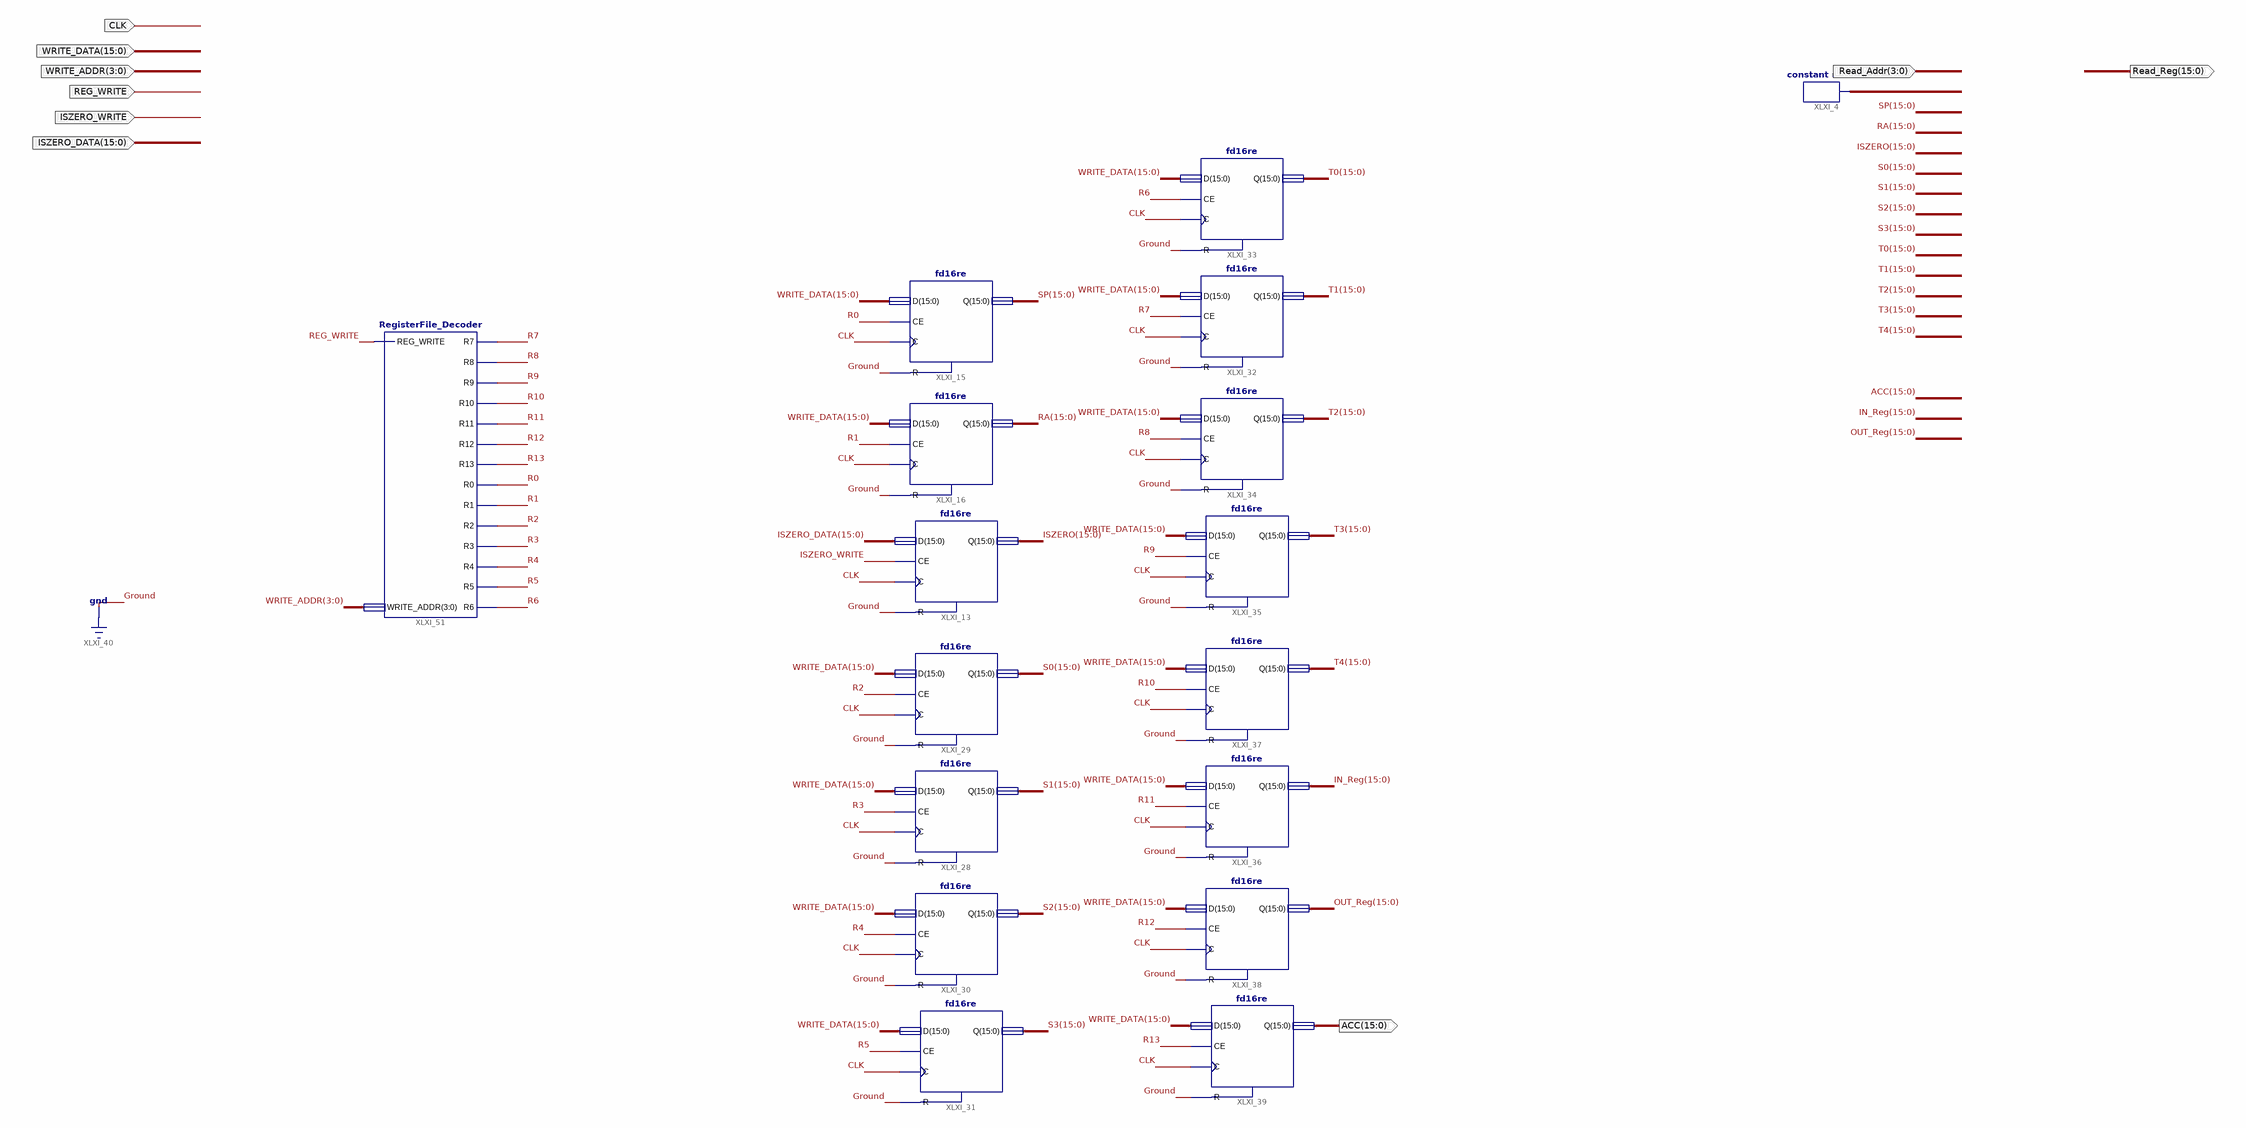
[diagram p0: schematic sheet 1]
// Xilinx ISE schematic Register_File.sch (spartan3e) as structural Verilog: 17 symbols, 9 ports
module Register_File (
  input  [3:0] Read_Addr,
  input  CLK,
  input  [15:0] WRITE_DATA,
  input  [3:0] WRITE_ADDR,
  input  REG_WRITE,
  input  ISZERO_WRITE,
  input  [15:0] ISZERO_DATA,
  output [15:0] Read_Reg,
  output [15:0] ACC
);

  wire R0, R1, R2, R3, R4, R5, R6, R7, R8, R9, R10, R11, R12, R13;
  wire [15:0] IN_Reg, ISZERO, OUT_Reg, RA, S0, S1, S2, S3, SP, T0, T1, T2, T3, T4, XLXN_2;

  fd16re XLXI_13 (.C(CLK), .CE(ISZERO_WRITE), .D(ISZERO_DATA), .R(1'b0), .Q(ISZERO));
  constant #(.CValue("0000")) XLXI_4 (.O(XLXN_2));
  fd16re XLXI_15 (.C(CLK), .CE(R0), .D(WRITE_DATA), .R(1'b0), .Q(SP));
  fd16re XLXI_16 (.C(CLK), .CE(R1), .D(WRITE_DATA), .R(1'b0), .Q(RA));
  fd16re XLXI_28 (.C(CLK), .CE(R3), .D(WRITE_DATA), .R(1'b0), .Q(S1));
  fd16re XLXI_29 (.C(CLK), .CE(R2), .D(WRITE_DATA), .R(1'b0), .Q(S0));
  fd16re XLXI_30 (.C(CLK), .CE(R4), .D(WRITE_DATA), .R(1'b0), .Q(S2));
  fd16re XLXI_31 (.C(CLK), .CE(R5), .D(WRITE_DATA), .R(1'b0), .Q(S3));
  fd16re XLXI_32 (.C(CLK), .CE(R7), .D(WRITE_DATA), .R(1'b0), .Q(T1));
  fd16re XLXI_33 (.C(CLK), .CE(R6), .D(WRITE_DATA), .R(1'b0), .Q(T0));
  fd16re XLXI_34 (.C(CLK), .CE(R8), .D(WRITE_DATA), .R(1'b0), .Q(T2));
  fd16re XLXI_35 (.C(CLK), .CE(R9), .D(WRITE_DATA), .R(1'b0), .Q(T3));
  fd16re XLXI_36 (.C(CLK), .CE(R11), .D(WRITE_DATA), .R(1'b0), .Q(IN_Reg));
  fd16re XLXI_37 (.C(CLK), .CE(R10), .D(WRITE_DATA), .R(1'b0), .Q(T4));
  fd16re XLXI_38 (.C(CLK), .CE(R12), .D(WRITE_DATA), .R(1'b0), .Q(OUT_Reg));
  fd16re XLXI_39 (.C(CLK), .CE(R13), .D(WRITE_DATA), .R(1'b0), .Q(ACC));
  RegisterFile_Decoder XLXI_51 (
    .REG_WRITE(REG_WRITE), .WRITE_ADDR(WRITE_ADDR), .R0(R0), .R1(R1), .R2(R2), .R3(R3), .R4(R4), .R5(R5),
    .R6(R6), .R7(R7), .R8(R8), .R9(R9), .R10(R10), .R11(R11), .R12(R12), .R13(R13));
endmodule
